# EAGLE design SparkFun Load Sensor Combinator (EAGLE 7.5.0)
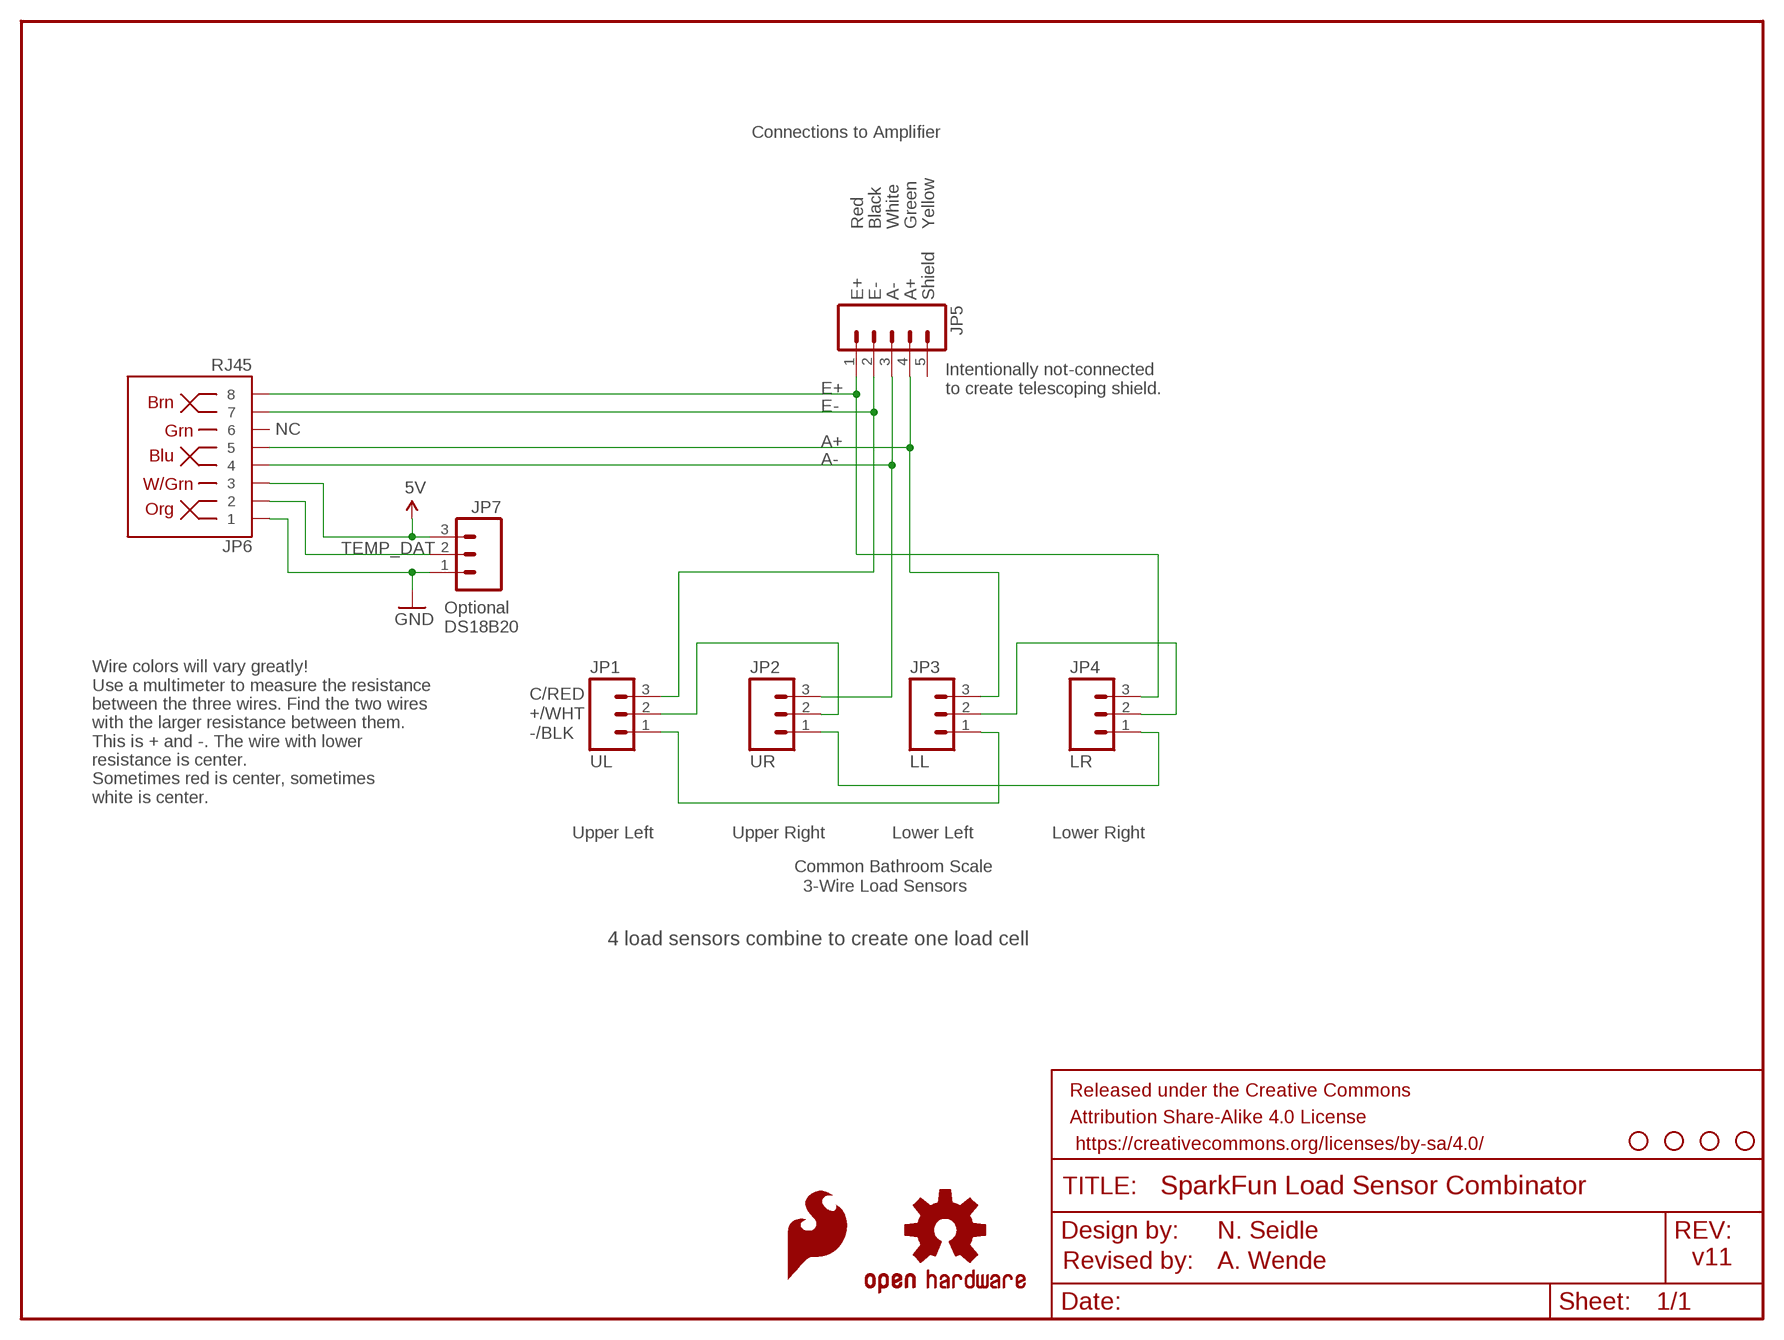
[diagram p0: schematic, sheet 1]

## Parts
FRAME1  FRAME-LETTER  [CREATIVE_COMMONS]
JP1  UL  M03PTH  [1X03]
JP2  UR  M03PTH  [1X03]
JP3  LL  M03PTH  [1X03]
JP4  LR  M03PTH  [1X03]
JP5  M05PTH  [1X05]
JP6  RJ45  RJ45-8PTH  [RJ45-8]
JP7  M03PTH  [1X03]
LOGO3  SFE_LOGO_FLAME.1_INCH  [SFE_LOGO_FLAME_.1]
STANDOFF1  STAND-OFF  [STAND-OFF]
STANDOFF2  STAND-OFF  [STAND-OFF]
STANDOFF3  STAND-OFF  [STAND-OFF]
STANDOFF4  STAND-OFF  [STAND-OFF]
U$7  OSHW-LOGOS  [OSHW-LOGO-S]

## Nets
5V: JP6.3 JP7.3
A+: JP3.3 JP5.4 JP6.5
A-: JP2.3 JP5.3 JP6.4
E+: JP4.3 JP5.1 JP6.8
E-: JP1.3 JP5.2 JP6.7
GND: JP6.1 JP7.1
N$1: JP2.1 JP4.1
N$2: JP1.1 JP3.1
N$3: JP3.2 JP4.2
N$4: JP1.2 JP2.2
TEMP_DAT: JP6.2 JP7.2
Unconnected: JP5.5 JP6.6

## Notes on the sheet
- Connections to Amplifier
- Red | Black | White | Green | Yellow
- E+ | E- | A- | A+ | Shield
- Intentionally not-connected
  to create telescoping shield.
- NC
- Optional
  DS18B20
- C/RED
- +/WHT
- -/BLK
- Wire colors will vary greatly\!
  Use a multimeter to measure the resistance
  between the three wires. Find the two wires
  with the larger resistance between them. 
  This is + and -. The wire with lower
  resistance is center.
  Sometimes red is center, sometimes
  white is center.
- Upper Left | Upper Right | Lower Left | Lower Right
- Common Bathroom Scale
- 3-Wire Load Sensors
- 4 load sensors combine to create one load cell
- N. Seidle
- Revised by: | A. Wende | v11

## Library data of the parts
FRAME1 = SparkFun-Aesthetics:FRAME-LETTER: Schematic Frame Standard 8.5x11 US Letter frame; DESIGNER: N. Seidle; VERSION: v02
JP1-JP4 JP7 = SparkFun-Connectors:M03: Header 3 Standard 3-pin 0.1" header. Use with straight break away headers (SKU : PRT-00116), right angle break away headers (PRT-00553), swiss pins (PRT-00743), machine pins (PRT-00117), and female headers (PRT-00115). Molex polarized connector foot print use with SKU : PRT-08232 with associated crimp pins and housings.
JP5 = SparkFun-Connectors:M05: Header 5 Standard 5-pin 0.1" header. Use with straight break away headers (SKU : PRT-00116), right angle break away headers (PRT-00553), swiss pins (PRT-00743), machine pins (PRT-00117), and female headers (PRT-00115). Molex polarized connector foot print use with SKU : PRT-08230 with associated crimp pins and housings.
JP6 = SparkFun-Connectors:RJ45-8: RJ45 Jack Simple RJ45, 8-pin connection - connector for common Cat5, Cat5e, and Cat6 Ethernet cables. Footprint not yet proven in production. Connector sku is PRT-00643; Breakout PCB sku is BOB-00716.; PROD_ID: CONN-08506
LOGO3 = SparkFun-Aesthetics:SFE_LOGO_FLAME: SFE Logo, flame only This is the SparkFun flame logo. The logo on the schematic will always be the same size; the package variant is the height of the flame. Default layer for the logo on the board is tSilk.
STANDOFF1-STANDOFF4 = SparkFun-Electromechanical:STAND-OFF: #4 Stand Off This is the mechanical footprint for a #4 phillips button head screw. Use the keepout ring to avoid running the screw head into surrounding components. SKU : PRT-00447
U$7 = SparkFun-Aesthetics:OSHW-LOGO: Open Source Hardware Logo This logo indicates the piece of hardware it is found on incorporates a OSHW license and/or adheres to the definition of open source hardware found here: http://freedomdefined.org/OSHW

## Board
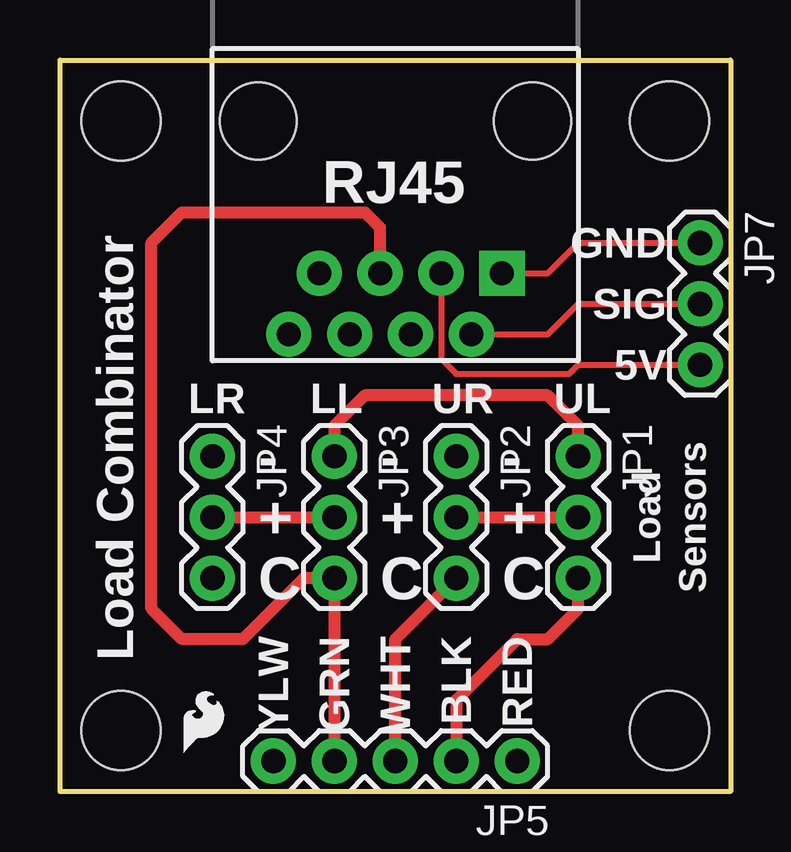
[diagram p1: board, top side]
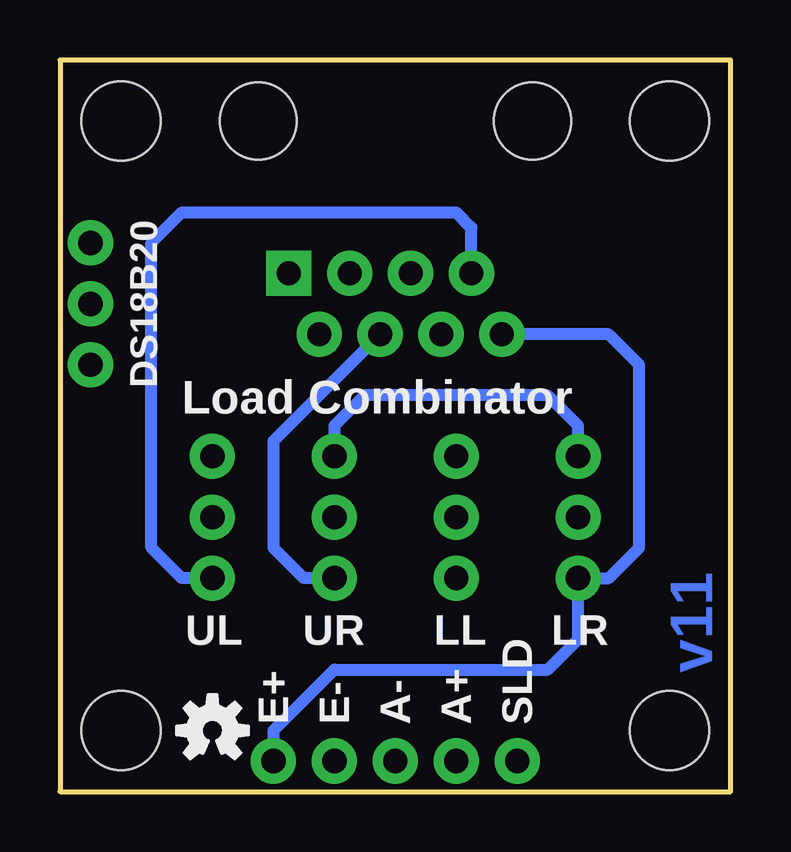
[diagram p2: board, bottom side, seen from below]

Size 27.94 x 30.48 mm. Coordinates in mm from the lower left corner, seen from the top.
Outline: 27.94,0 0,0 0,30.48 27.94,30.48 27.94,0
Copper layers (1*16): Top 0.035mm / dielectric 1.5mm / Bottom 0.035mm
Design rules "default *": minimum track width 8mil, minimum drill 20mil, track to track 8mil, track to pad 8mil, pad to pad 8mil, via to via 8mil, smd to smd 8mil, copper to edge 8mil, drill to drill 8mil, minimum pad ring 12mil, minimum via ring 10mil, stop-mask expansion 4mil, vias tented up to drill 20mil, thermal gap 10mil

### Footprints (pad centres in the part's own frame; a part is rotated, then mirrored left to right if it is on the bottom)
1X03 = drill 1.016 pad 1.88: 1 0,0; 2 2.54,0; 3 5.08,0
1X05 = drill 1.016 pad 1.88: 1 0,0; 2 2.54,0; 3 5.08,0; 4 7.62,0; 5 10.16,0
RJ45-8 = drill 1 pad 1.88 square: 1 -4.445,6.35 | drill 1 pad 1.88: 2 -3.175,8.89; 3 -1.905,6.35; 4 -0.635,8.89; 5 0.635,6.35; 6 1.905,8.89; 7 3.175,6.35; 8 4.445,8.89 | hole 3.2: -5.715,0; 5.715,0
STAND-OFF = hole 3.302: 0,0

### Placement (x,y rotation side)
FRAME1  -12.7,-11.43 0 top  (outside the outline)
JP1  21.59,13.97 270 top
JP2  16.51,13.97 270 top
JP3  11.43,13.97 270 top
JP4  6.35,13.97 270 top
JP5  19.05,1.27 180 top
JP6  13.97,27.94 180 top
JP7  26.67,22.86 270 top
LOGO3  4.83,1.27 0 top
STANDOFF1  25.4,27.94 180 top
STANDOFF2  2.54,27.94 180 top
STANDOFF3  25.4,2.54 180 top
STANDOFF4  2.54,2.54 180 top
U$7  21.59,2.54 0 bottom

### Tracks (layer width: path | path; a pad name or v marks a point on that pad's centre or on a via)
5V
  Top 0.254: JP6.3 15.88,18.03 16.51,17.4 21.21,17.4 21.59,17.78 JP7.3
A+
  Top 0.508: JP5.4 JP3.3 10.16,8.89 7.62,6.35 5.08,6.35 3.81,7.62 3.81,22.86 5.08,24.13 12.7,24.13 13.34,23.5 JP6.5
A-
  Top 0.508: JP5.3 13.97,6.35 JP2.3
  Bottom 0.508: JP2.3 17.78,8.89 19.05,10.16 19.05,14.61 JP6.4
E+
  Bottom 0.508: JP5.1 19.05,2.54 16.51,5.08 7.62,5.08 6.35,6.35 JP4.3 5.08,8.89 3.81,10.16 3.81,17.78 5.08,19.05 JP6.8
E-
  Top 0.508: JP1.3 21.59,7.62 20.32,6.35 19.05,6.35 16.51,3.81 JP5.2
  Bottom 0.508: JP1.3 22.86,8.89 24.13,10.16 24.13,22.86 22.86,24.13 11.43,24.13 10.79,23.5 JP6.7
GND
  Top 0.254: JP6.1 20.32,21.59 21.59,22.86 JP7.1
N$1
  Bottom 0.508: JP4.1 6.35,15.24 7.62,16.51 15.24,16.51 16.51,15.24 JP2.1
N$2
  Top 0.508: JP1.1 21.59,15.24 20.32,16.51 12.7,16.51 11.43,15.24 JP3.1
N$3
  Top 0.508: JP4.2 JP3.2
N$4
  Top 0.508: JP2.2 JP1.2
TEMP_DAT
  Top 0.254: JP6.2 20.32,19.05 21.59,20.32 JP7.2

### Text on the board
Bottom: v11
tPlace: RJ45 | GND | SIG | 5V | LR | LL | UR | UL | - | - | - | + | + | + | Load | Sensors | C | C | C | YLW | GRN | WHT | BLK | RED | Load Combinator
bPlace: DS18B20 | Load Combinator | LR | LL | UR | UL | SLD | A+ | A- | E- | E+
Measures: Units are in inches
tDocu: N. Seidle | Revised by: | A. Wende